# Altium schematic sheet I2C_sensors.SchDoc: I2C Sensors
size A; Author: Sam Bagley; CompanyName: BYUI; DrawnBy: Sam Bagley; Engineer: Sam Bagley; Organization: CSEE; DocumentNumber: 9; Revision: 0.0.1; SheetNumber: 9; SheetTotal: 15
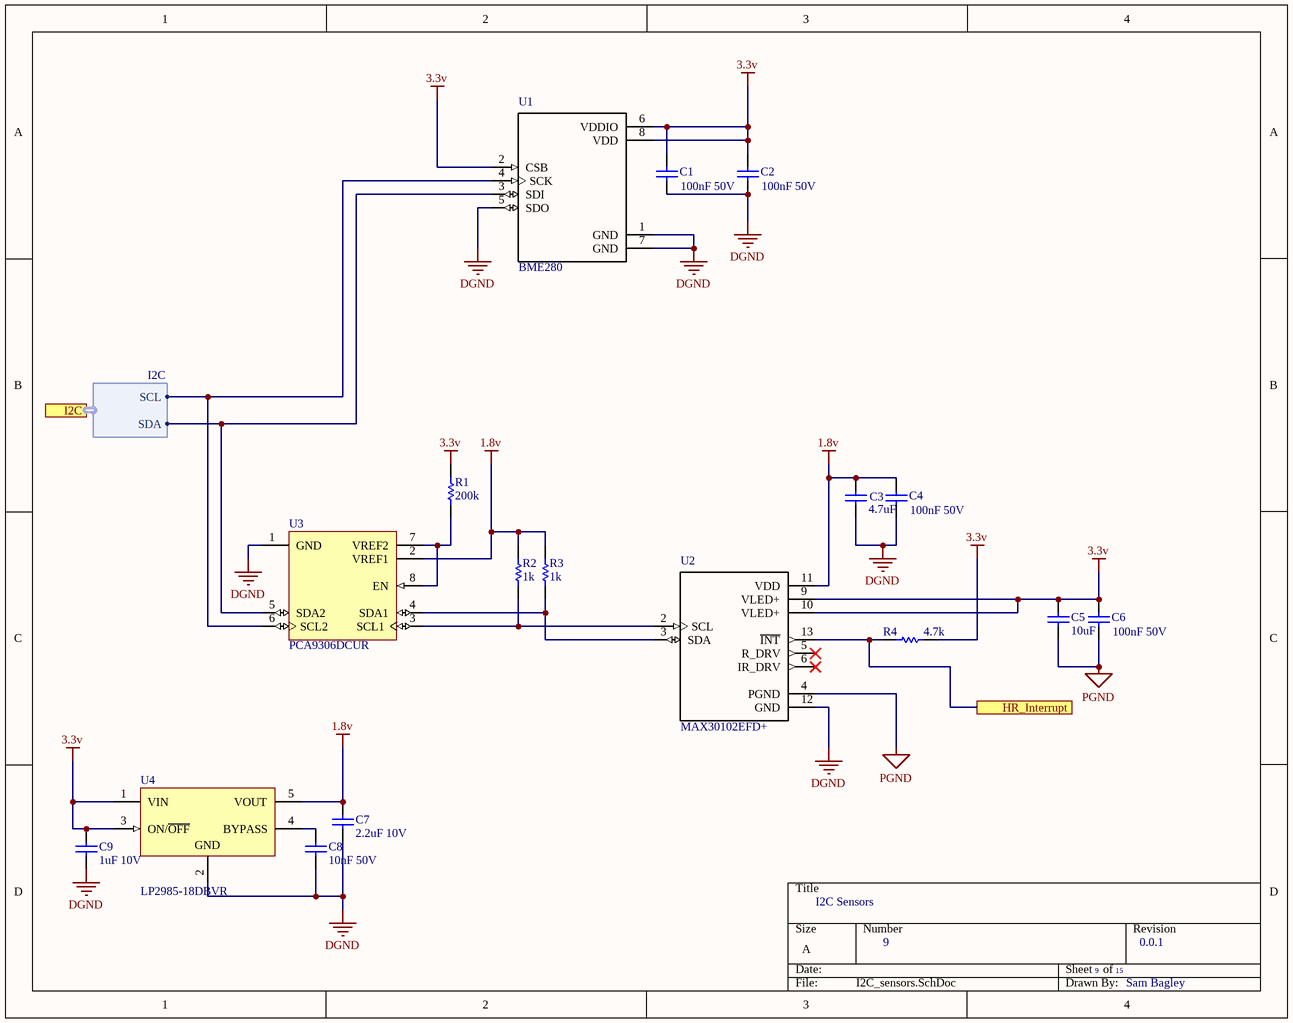
[diagram p0: I2C_sensors.SchDoc]

## Parts
C1  100nF 50V  [CAPC0603(1608)100_M]
C2  100nF 50V  [CAPC0603(1608)100_M]
C3  4.7uF  [CAPC1608X87X35NL15T15]
C4  100nF 50V  [CAPC0603(1608)100_M]
C5  10uF  [CAPC1608X90X20LL10]
C6  100nF 50V  [CAPC0603(1608)100_M]
C7  2.2uF 10V  [CAPC1608X90X35ML10T15]
C8  10nF 50V  [CAPC1608X90X40ML10T20]
C9  1uF 10V  [CAPC1608X90X35ML15T15]
R1  200k  [RESC1608X55X30LL15T15]
R2  1k  [RESC1608X55X30LL20T20]
R3  1k  [RESC1608X55X30LL20T20]
R4  4.7k  [RESC1608X55X30LL15T15]
U1  BME280  [*PSON65P250X250X100-8N]
U2  MAX30102EFD+  [MAX30201]
U3  PCA9306DCUR  [DCU0008A_M]
U4  LP2985-18DBVR  [DBV0005A_M]

## Ports
HR_Interrupt, I2C (harness I2C)

## Harnesses
I2C: SCL, SDA

## Nets
1.8v: C3.2 C4.2 C7.2 R2.2 R3.2 U2.11(VDD) U3.2(VREF1) U4.5(VOUT)
3.3v: C1.2 C2.2 C5.2 C6.2 C9.2 R1.2 R4.2 U1.2(CSB) U1.6(VDDIO) U1.8(VDD) U2.9(VLED+) U2.10(VLED+) U4.1(VIN) U4.3(ON/~{OFF})
DGND: C1.1 C2.1 C3.1 C4.1 C7.1 C8.1 C9.1 U1.1(GND) U1.5(SDO) U1.7(GND) U2.12(GND) U3.1(GND) U4.2(GND)
PGND: C5.1 C6.1 U2.4(PGND)
HR_Interrupt: R4.1 U2.13(~{INT}) ; port HR_Interrupt
NetC8_2: C8.2 U4.4(BYPASS)
NetR1_1: R1.1 U3.7(VREF2) U3.8(EN)
NetR2_1: R2.1 U2.2(SCL) U3.3(SCL1)
NetR3_1: R3.1 U2.3(SDA) U3.4(SDA1)
NetU1_3: U1.3(SDI) U3.5(SDA2) ; port I2C.SDA
NetU1_4: U1.4(SCK) U3.6(SCL2) ; port I2C.SCL

Not connected (* = marked no-connect by the designer): U2 5(R_DRV)* 6(IR_DRV)*

## Library data of the parts
C1 C2 C4 C6 = CMP-1035-02594-1: CAP 100nF 50V -20% to +80% 0603 (1608 Metric) Thickness 1mm SMD; Case-Metric: 1608; Case-EIA: 0603; Technology: SMT; Rated Voltage: 50 V; Value: 100nF; Max Thickness: 1 mm; Tolerance: -20% to +80%
  C1: ComponentLink1Description: New link; ComponentLink1URL: *
C3 = CMP-2006-03238-1: CAP 4.7uF 0603; Part Number: C0603C475K8PACTU; Manufacturer: Kemet
C5 = CMP-2000-04979-1: Chip Capacitor, 10 uF, +/- 10%, 10 V, -55 to 85 degC, 0603 (1608 Metric), RoHS, Tape and Reel; PCN Part Number: MLCCPartNumberChange30/Nov/2012; Manufacturer: TDK; Manufacturer Part Number: C1608X5R1A106K080AC; Temperature Coefficient: X5R; Product Training Modules: CSeriesGeneralApplicationsSEAT,CCV,andTVCLDesignToolsGuidetoReplacinganElectrolyticCapacitorwithanMLCC; Online Catalog: CSeries,GeneralPurpose; Voltage - Rated: 10V; Other Names: 445-7486-1; Design Resources: 20WNon-IsolatedBuckLEDDriverUsingPLLNK460KG; Kits: 445-9003-KIT-ND-KITCAPCERHICAPMLCCSMD; Height - Seated (Max): -; Family: CeramicCapacitors; Package Description: 2-Pin Surface Mount Device, Body 1.6 x 0.8 mm; Category: Capacitors; Datasheet Version: Mar-15; RoHS Information: RoHSCertificate-MLCC; Thickness (Max): 0.035"(0.90mm); Operating Temperature: -55degC~85degC; Package Reference: 603; Series: C; Applications: GeneralPurpose; Datasheet URL: http://download.siliconexpert.com/pdfs/2015/4/21/15/54/45/779/tdk_/manual/37024850441143360mlcc_commercial_general_en.pdf; Features: -; Lead Style: -; Lead Spacing: -; Ratings: -; Size / Dimension: 0.063"Lx0.031"W(1.60mmx0.80mm); Tolerance: ±10%; Mounting Type: SurfaceMount,MLCC; Standard Package: 1; Package / Case: 0603(1608Metric); Manufacturer URL: http://www.tdk.com/; Packaging: CutTape(CT); Supplier 1: Digi-Key
C7 = CMP-2006-02836-1: CAP CER 2.2uF 10V 0603; Manufacturer: Murata; Part Number: GRM188R71A225KE15D
C8 = CMP-2100-03600-1: Chip Capacitor, 10 nF, +/- 10%, 50 V, -55 to 125 degC, 0603 (1608 Metric), RoHS, Tape and Reel; Manufacturer: Yageo; Insulation Resistance: 100GR; Dielectric: X7R; Material: Ceramic; Lead Free: LeadFree; Case/Package: 0603; Datasheet Version: Rev. 15, 10/2016; Composition: Ceramic; Radiation Hardening: No; Thickness: 0.035inch; RoHSCompliant: True; Voltage Rating (DC): 50V; Termination: SMD/SMT; Capacitance: 10nF; Manufacturer URL: http://www.yageo.com/; Tolerance: 10%; REACH SVHC: NoSVHC; Voltage: 50V; Max Operating Temperature: 125degC; Case Code (Metric): 1608; Package Quantity: 1; Case Code (Imperial): 0603; Packaging: TapeandReel; Package Reference: 0603; Width: 0.031inch; Datasheet URL: http://www.yageo.com/documents/recent/UPY-GPHC_X7R_6.3V-to-50V_15.pdf; Length: 1.6mm; Min Operating Temperature: -55degC; Number of Pins: 2; Depth: 0.8mm; Mount: SurfaceMount; Height: 0.8mm; Voltage Rating: 50V; Package Description: 2-Pin Surface Mount Device, Body 1.6 x 0.8 mm
C9 = CMP-2006-02287-1: CAP CER 1uF 10V 0603; Manufacturer: Kemet; Part Number: C0603C105K8PAC7867
R1 = CMP-2000-00743-1: Part Number: ERJ-3GEYJ204V; Manufacturer: Panasonic
R2 R3 = CMP-2000-00873-1: Manufacturer: Panasonic; Part Number: ERA3AEB102V
R4 = CMP-2000-00522-1: Part Number: ERJ3EKF4701V; Manufacturer: Panasonic
U1 = BME280: / Humidity Temperature Sensor 0 ~ 100% RH IÂ²C, SPI Â±3% 1s Surface Mount /; MF: Bosch; Availability: Unavailable; Package: LGA-8 Bosch; MP: BME280; SnapEDA_Link: https://www.snapeda.com/parts/BME280/Bosch%20Sensortec/view-part/49769/?ref=snap; Price: None; Value: *
U2 = MAX30102EFD+: / Oximeter/Heart Rate Sensor IÂ²C Output /; MF: Maxim Integrated; Price: None; MP: MAX30102EFD+; SnapEDA_Link: https://www.snapeda.com/parts/MAX30102EFD%2B/Maxim%20Integrated/view-part/397548/?ref=snap; Package: OLGA-14 Maxim; Availability: Unavailable; Value: *
U3 = CMP-0314-00419-2: Dual Bi-Directional I2C-Bus and SMBus Voltage Level-Translator, 0 to 5.5 V, -40 to 85 degC, 8-pin US8 (DCU), Green (RoHS & no Sb/Br); Manufacturer: Texas Instruments; tpd max(ns): 1.5; Function: Voltage Translator; Enable Pin: Yes; Rating: Catalog; SubFamily: I2C Special Function; Max Frequency(kHz): 400; Vcc range(V): 0 to 5.5; No. of Outputs: 2; PackageVersion: revF, Jul-2005; Eco-Plan: Green (RoHS & no Sb/Br); ComponentLink2Description: Package Specification; ComponentLink1URL: http://www.ti.com/general/docs/lit/getliterature.tsp?genericPartNumber=PCA9306&fileType=pdf; DatasheetVersion: SCPS113J; On-Chip Power-on-Reset: No; PackageDescription: 8-Pin Thin Shrink Small Outline Package 0.5 mm Pitch; Code_JEDEC: MO-187-CA; PackageReference: DCU0008A; 5V Tolerant I/O: Yes; Open Drain I/O Type: Yes; Mounting Technology: Surface Mount; fSCLK(Max)(MHz): 400; PartNumber: PCA9306DCUR; ComponentLink1Description: Datasheet; ComponentLink2URL: http://www.ti.com/litv/pdf/mpds050d
U4 = CMP-0758-00065-2: Single Output Low Noise LDO, 150 mA, Fixed 1.8 V Output, 1.5% Tolerance, 2.2 to 16 V Input, Low IQ, 5-Pin SOT-23 (DBV), -40 to 125 degC, Green (RoHS & no Sb/Br), Tape and Reel; Manufacturer: Texas Instruments; Vdo (Typ) (mV): 280; Iout (Max) (A): 0.15; Output Options: Fixed Output; Iq (Typ) (mA): 0.85; Accuracy (%): 1.5; Fixed Output Options (V): 1.8; PackageReference: DBV0005A; DatasheetVersion: SLVS522N; RoHS: TRUE; ComponentLink1URL: http://www.ti.com/; ComponentLink3URL: http://www.ti.com/litv/pdf/mpds018j; ComponentLink3Description: Package Specification; Operating Temperature Range (degC): -40 to 125; Vin (V): 2.2 to 16; ComponentLink2URL: http://www.ti.com/lit/ds/symlink/lp2985-50.pdf; PartNumber: LP2985-18DBVR; Packing: Tape and Reel; Mounting Technology: Surface Mount; PackageDescription: 5-Pin Plastic Small Outline, Body 2.9 x 1.6 mm, Pitch 0.95 mm; ComponentLink2Description: Datasheet; PackageVersion: 4073253-4/L; ComponentLink1Description: Manufacturer URL